# Altium schematic sheet CongSuat_SCH.SchDoc
size A4
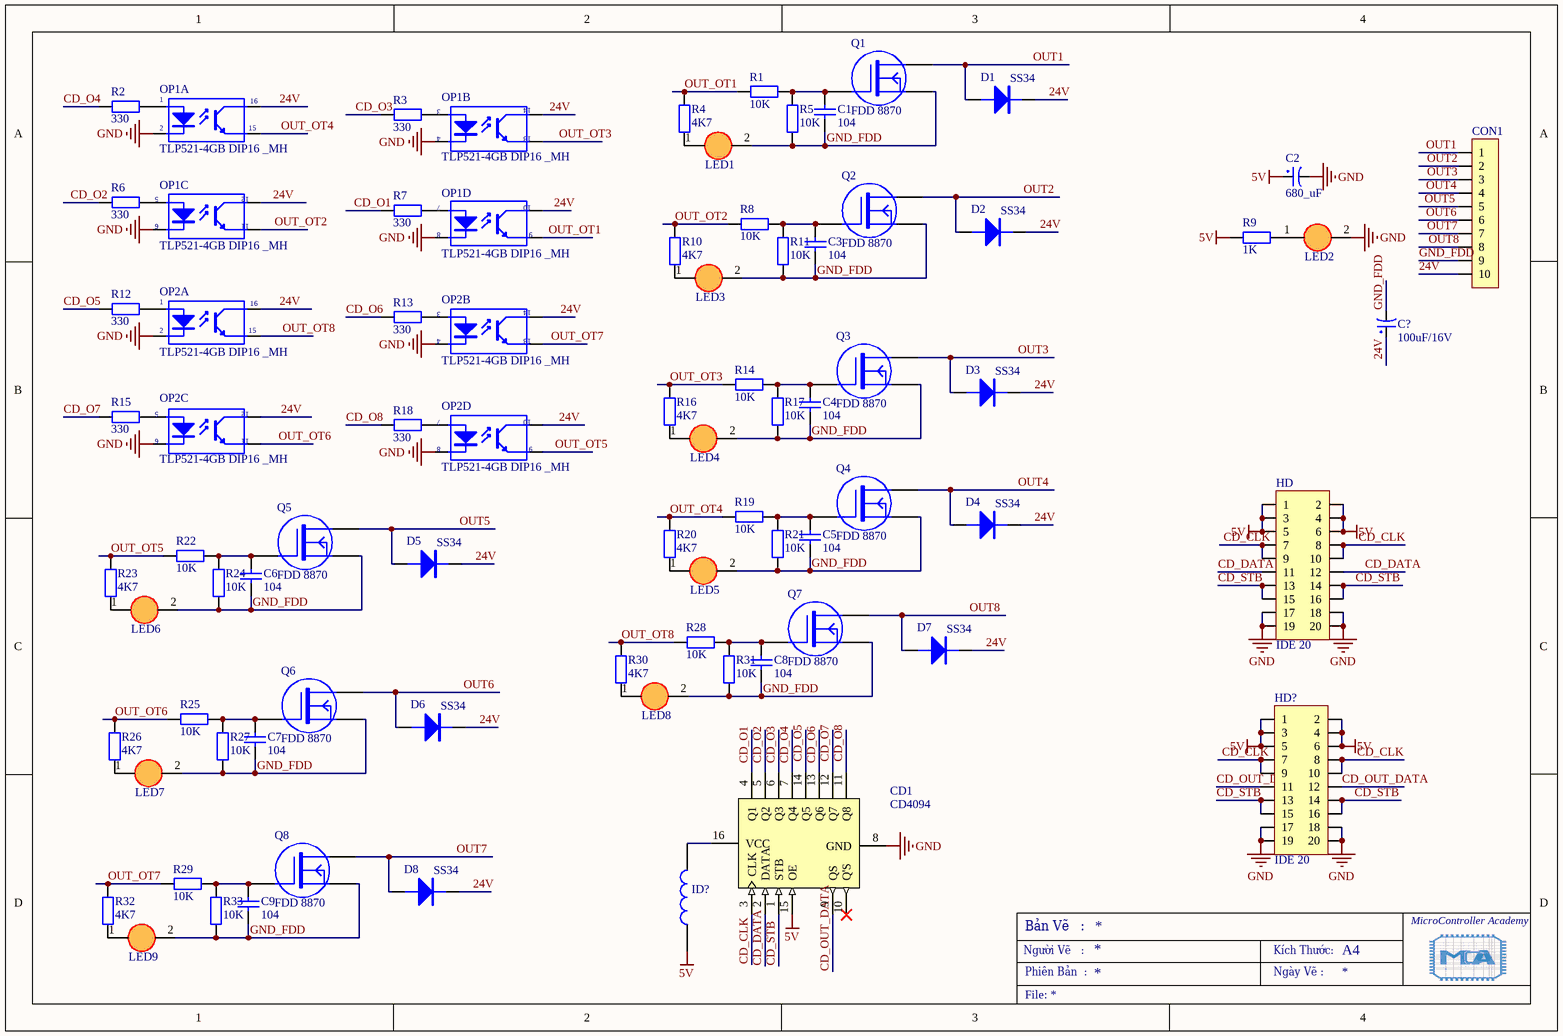
[diagram p0: CongSuat_SCH.SchDoc]

## Parts
C1  104  [TU_SMD_0805]
C2  680_uF  [TU_HOA(100uF/35V - 470uF/16V)]
C3  104  [TU_SMD_0805]
C4  104  [TU_SMD_0805]
C5  104  [TU_SMD_0805]
C6  104  [TU_SMD_0805]
C7  104  [TU_SMD_0805]
C8  104  [TU_SMD_0805]
C9  104  [TU_SMD_0805]
C?  100uF/16V  [TU_HOA(100uF/35V - 470uF/16V)]
CD1  CD4094  [DIP16]
CON1  CON 10 KF762_MH  [CON 10 KF762]  (value not drawn)
D1  SS34  [SOD80]
D2  SS34  [SOD80]
D3  SS34  [SOD80]
D4  SS34  [SOD80]
D5  SS34  [SOD80]
D6  SS34  [SOD80]
D7  SS34  [SOD80]
D8  SS34  [SOD80]
HD  IDE 20  [CABLE 20]
HD?  IDE 20  [CABLE 20]
ID?  Inductor 0805_MH  [TU_SMD_0805]  (value not drawn)
LED1  LED3  [LED 3mm Do]  (value not drawn)
LED2  LED3  [LED 3mm Do]  (value not drawn)
LED3  LED3  [LED 3mm Do]  (value not drawn)
LED4  LED3  [LED 3mm Do]  (value not drawn)
LED5  LED3  [LED 3mm Do]  (value not drawn)
LED6  LED3  [LED 3mm Do]  (value not drawn)
LED7  LED3  [LED 3mm Do]  (value not drawn)
LED8  LED3  [LED 3mm Do]  (value not drawn)
LED9  LED3  [LED 3mm Do]  (value not drawn)
OP1  TLP521-4GB DIP16 _MH  [DIP16]  (parts A,B,C,D of 4)
OP2  TLP521-4GB DIP16 _MH  [DIP16]  (parts A,B,C,D of 4)
Q1  FDD 8870  [TO-252]
Q2  FDD 8870  [TO-252]
Q3  FDD 8870  [TO-252]
Q4  FDD 8870  [TO-252]
Q5  FDD 8870  [TO-252]
Q6  FDD 8870  [TO-252]
Q7  FDD 8870  [TO-252]
Q8  FDD 8870  [TO-252]
R1  10K  [TRO_SMD_1206]
R2  330  [Tro SMD 0805]
R3  330  [Tro SMD 0805]
R4  4K7  [Tro SMD 0805]
R5  10K  [TRO_SMD_1206]
R6  330  [Tro SMD 0805]
R7  330  [Tro SMD 0805]
R8  10K  [TRO_SMD_1206]
R9  1K  [Tro SMD 0805]
R10  4K7  [Tro SMD 0805]
R11  10K  [TRO_SMD_1206]
R12  330  [Tro SMD 0805]
R13  330  [Tro SMD 0805]
R14  10K  [TRO_SMD_1206]
R15  330  [Tro SMD 0805]
R16  4K7  [Tro SMD 0805]
R17  10K  [TRO_SMD_1206]
R18  330  [Tro SMD 0805]
R19  10K  [TRO_SMD_1206]
R20  4K7  [Tro SMD 0805]
R21  10K  [TRO_SMD_1206]
R22  10K  [TRO_SMD_1206]
R23  4K7  [Tro SMD 0805]
R24  10K  [TRO_SMD_1206]
R25  10K  [TRO_SMD_1206]
R26  4K7  [Tro SMD 0805]
R27  10K  [TRO_SMD_1206]
R28  10K  [TRO_SMD_1206]
R29  10K  [TRO_SMD_1206]
R30  4K7  [Tro SMD 0805]
R31  10K  [TRO_SMD_1206]
R32  4K7  [Tro SMD 0805]
R33  10K  [TRO_SMD_1206]

## Nets
5V: C2.1 CD1.15(OE) HD.1 HD.2 HD.3 HD.4 HD.5 HD.6 HD?.1 HD?.2 HD?.3 HD?.4 HD?.5 HD?.6 ID?.1 R9.1
GND: C2.2 CD1.8(GND) HD.17 HD.18 HD.19 HD.20 HD?.17 HD?.18 HD?.19 HD?.20 LED2.2(K) OP1.2(K) OP1.4(K) OP1.6(K) OP1.8(K) OP2.2(K) OP2.4(K) OP2.6(K) OP2.8(K)
24V: C?.1 CON1.10 D1.2 D2.2 D3.2 D4.2 D5.2 D6.2 D7.2 D8.2 OP1.10(C) OP1.12(C) OP1.14(C) OP1.16(C) OP2.10(C) OP2.12(C) OP2.14(C) OP2.16(C)
CD_CLK: CD1.3(CLK) HD.7 HD.8 HD.9 HD.10 HD?.7 HD?.8 HD?.9 HD?.10
CD_DATA: CD1.2(DATA) HD.11 HD.12
CD_O1: CD1.4(Q1) R7.1
CD_O2: CD1.5(Q2) R6.1
CD_O3: CD1.6(Q3) R3.1
CD_O4: CD1.7(Q4) R2.1
CD_O5: CD1.14(Q5) R12.1
CD_O6: CD1.13(Q6) R13.1
CD_O7: CD1.12(Q7) R15.1
CD_O8: CD1.11(Q8) R18.1
CD_OUT_DATA: CD1.9(QS) HD?.11 HD?.12
CD_STB: CD1.1(STB) HD.13 HD.14 HD.15 HD.16 HD?.13 HD?.14 HD?.15 HD?.16
GND_FDD: C1.1 C3.1 C4.1 C5.1 C6.1 C7.1 C8.1 C9.1 C?.2 CON1.9 LED1.2(K) LED3.2(K) LED4.2(K) LED5.2(K) LED6.2(K) LED7.2(K) LED8.2(K) LED9.2(K) Q1.3(S) Q2.3(S) Q3.3(S) Q4.3(S) Q5.3(S) Q6.3(S) Q7.3(S) Q8.3(S) R5.1 R11.1 R17.1 R21.1 R24.1 R27.1 R31.1 R33.1
OUT1: CON1.1 D1.1 Q1.2(D)
OUT2: CON1.2 D2.1 Q2.2(D)
OUT3: CON1.3 D3.1 Q3.2(D)
OUT4: CON1.4 D4.1 Q4.2(D)
OUT5: CON1.5 D5.1 Q5.2(D)
OUT6: CON1.6 D6.1 Q6.2(D)
OUT7: CON1.7 D8.1 Q8.2(D)
OUT8: CON1.8 D7.1 Q7.2(D)
OUT_OT1: OP1.9(E) R1.2 R4.1
OUT_OT2: OP1.11(E) R8.2 R10.1
OUT_OT3: OP1.13(E) R14.2 R16.1
OUT_OT4: OP1.15(E) R19.2 R20.1
OUT_OT5: OP2.9(E) R22.2 R23.1
OUT_OT6: OP2.11(E) R25.2 R26.1
OUT_OT7: OP2.13(E) R29.2 R32.1
OUT_OT8: OP2.15(E) R28.2 R30.1
NetC1_2: C1.2 Q1.1(G) R1.1 R5.2
NetC3_2: C3.2 Q2.1(G) R8.1 R11.2
NetC4_2: C4.2 Q3.1(G) R14.1 R17.2
NetC5_2: C5.2 Q4.1(G) R19.1 R21.2
NetC6_2: C6.2 Q5.1(G) R22.1 R24.2
NetC7_2: C7.2 Q6.1(G) R25.1 R27.2
NetC8_2: C8.2 Q7.1(G) R28.1 R31.2
NetC9_2: C9.2 Q8.1(G) R29.1 R33.2
NetCD1_16: CD1.16(VCC) ID?.2
NetLED1_1: LED1.1(A) R4.2
NetLED2_1: LED2.1(A) R9.2
NetLED3_1: LED3.1(A) R10.2
NetLED4_1: LED4.1(A) R16.2
NetLED5_1: LED5.1(A) R20.2
NetLED6_1: LED6.1(A) R23.2
NetLED7_1: LED7.1(A) R26.2
NetLED8_1: LED8.1(A) R30.2
NetLED9_1: LED9.1(A) R32.2
NetOP1_1: OP1.1(A) R2.2
NetOP1_3: OP1.3(A) R3.2
NetOP1_5: OP1.5(A) R6.2
NetOP1_7: OP1.7(A) R7.2
NetOP2_1: OP2.1(A) R12.2
NetOP2_3: OP2.3(A) R13.2
NetOP2_5: OP2.5(A) R15.2
NetOP2_7: OP2.7(A) R18.2

Not connected (* = marked no-connect by the designer): CD1 10(Q'S)*

## Notes on the sheet
- MicroController Academy
- Người Vẽ   :
- Phiên Bản  :
- Bản Vẽ   :
- Kích Thước:
- Ngày Vẽ :
- A4
- File:

## Library data of the parts
C1 C3-C9 = TU_SMD_0805_MH
C2 = TU_HOA_680_uF_25V_MH: TU_HOA_680_uF_25V; Value: 100uF/35V/50V; Description 1: 1000uF/6,3V - 470uF/16V - 330uF - 25V; Description 2: 220uF/35V - 100uF/50V - 63V - 4,7uF/200V; Description 3: 22uF => 33uF100V - 3,3uF => 4,7uF/250V; Description 4: 2,2uF =>3,3uF/350 - 2,2uF/400V - 1uF/450V
C? = TU_HOA_100uF_50V_MH: TU_HOA_100uF_50V; Value: 100uF/35V/50V; Description 1: 1000uF/6,3V - 470uF/16V - 330uF - 25V; Description 2: 220uF/35V - 100uF/50V - 63V - 4,7uF/200V; Description 3: 22uF => 33uF100V - 3,3uF => 4,7uF/250V; Description 4: 2,2uF =>3,3uF/350 - 2,2uF/400V - 1uF/450V
CON1 = CON 10 KF762_MH: CON 10 KF762 - 10P 7.62mm
D1-D8 = Diode 1N4148 SOD80 450mA 100V ( LL34 1N4148 SMD)_MH: Diode 1N4148 SOD80 450mA 100V ( LL34 1N4148 SMD)
HD HD? = IDE 20: IDE header 20P
ID? = Inductor 0805_MH: cuon cam 0805
LED1-LED9 = LED 3mm_MH: LED 3mm
R1 R5 R8 R11 R14 R17 R19 R21 R22 R24 R25 R27-R29 R31 R33 = TRO_SMD_1206_MH
R2-R4 R6 R7 R9 R10 R12 R13 R15 R16 R18 R20 R23 R26 R30 R32 = TRO_SMD_0805_MH: TRO_SMD_0805
OP1 OP2 = TLP521-4GB DIP16 _MH: Value: TLP521-4